# Altium schematic sheet CPU.SchDoc
size A4
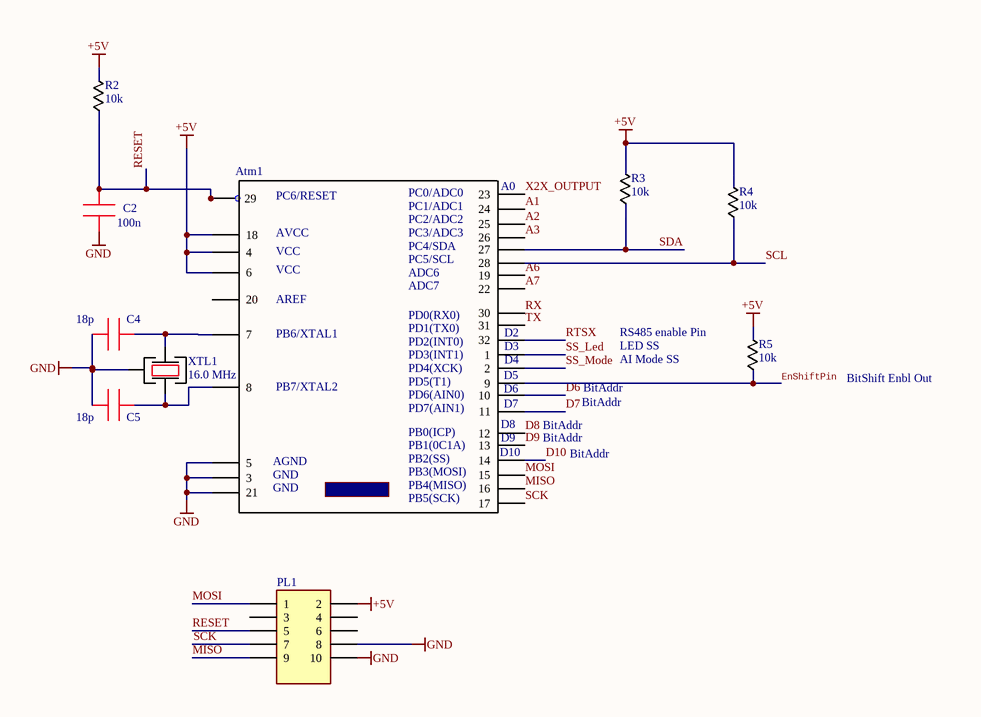
[diagram p0: CPU.SchDoc]

## Parts
Atm1  (no value)  [TQFP]
C2  100n  [0603 - Cap]
C4  18p  [0603 - Cap]
C5  18p  [0603 - Cap]
PL1  (no value)  [IDC-10MS]
R2  10k  [0603_Res]
R3  10k  [0603_Res]
R4  10k  [0603_Res]
R5  10k  [0603_Res]
XTL1  16.0 MHz  [KX-7 XTAL]

## Nets
+5V: Atm1.4 Atm1.6 Atm1.18 PL1.2 R2.2 R3.2 R4.2 R5.2
GND: Atm1.3 Atm1.5 Atm1.21 C2.1 C4.1 C5.1 PL1.8 PL1.10 XTL1.2
A1: Atm1.24
A2: Atm1.25
A3: Atm1.26
A6: Atm1.19
A7: Atm1.22
D6: Atm1.10
D7: Atm1.11
D8: Atm1.12
D9: Atm1.13
D10: Atm1.14
EnShiftPin: Atm1.9 R5.1
MISO: Atm1.16 PL1.9
MOSI: Atm1.15 PL1.1
RESET: Atm1.29 C2.2 PL1.5 R2.1
RTSX: Atm1.32
RX: Atm1.30
SCK: Atm1.17 PL1.7
SCL: Atm1.28 R4.1
SDA: Atm1.27 R3.1
SS_Led: Atm1.1
SS_Mode: Atm1.2
TX: Atm1.31
X2X_OUTPUT: Atm1.23
NetAtm1_7: Atm1.7 C4.2 XTL1.1
NetAtm1_8: Atm1.8 C5.2 XTL1.3

Not connected (* = marked no-connect by the designer): Atm1 20; PL1 3 4 6

## Notes on the sheet
- (near Atm1) A0
- (near Atm1) D3
- (near Atm1) D2
- (near R5) RS485 enable Pin
- LED SS
- (near Atm1) D5
- (near Atm1) D6
- (near Atm1) D7
- (near Atm1) D4
- BitAddr
- AI Mode SS
- BitShift Enbl Out
- (near Atm1) D10
- (near Atm1) D8
- (near Atm1) D9
- (near Atm1) BitAddr
- (in symbol Atmega328) PC6/RESET; PC0/ADC0; PC1/ADC1; PC2/ADC2; AVCC; PC3/ADC3; PC4/SDA; VCC; PC5/SCL; ADC6; ADC7; AREF; PD0(RX0); PD1(TX0); PB6/XTAL1; PD2(INT0); PD3(INT1); PD4(XCK); PD5(T1); PB7/XTAL2; PD6(AIN0); PD7(AIN1); PB0(ICP); PB1(0C1A); PB2(SS); AGND; PB3(MOSI); GND; ATMega328; PB4(MISO); PB5(SCK)

## Library data of the parts
Atm1 = Atmega328: Part Description: 8-bit  MCU 32KB In-system Flash 20MHz 1.8V-5.5V; Part Number: Atmega328P-AU
C2 = Capasitor 0805: CC0603ZRY5V9BB104; Part Description: Ceramic Capacitors SMD 50 V 0.1uF X7R 0603 10%; Part Number: CC0603KRX7R9BB104
C4 C5 = Capasitor 0805: Part Description: Cap SMD/SMT 50 V 18 pF C0G 0603 5%; Part Number: CC0603JRNPO9BN180
PL1 = IDC-10MS: Part Description: IDC Connector 2х5; Part Number: DS1013-10SSIB1-B-0
R2 = Resistor 0805: RT0603FRE0710KL; Part Description: SMD  Resistor 0603, 10kOhms, 1%, 1/10W; Part Number: RC0603FR-0710KL
R3-R5 = Resistor 0805: RC0402FR-0710KL; Part Description: SMD  Resistor 0603, 10kOhms, 1%, 1/10W; Part Number: RC0603FR-0710KL
XTL1 = KX-7: Part Description: Oscillator  16.0 MHz; Part Number: Geyer KX-7 16.0 MHz